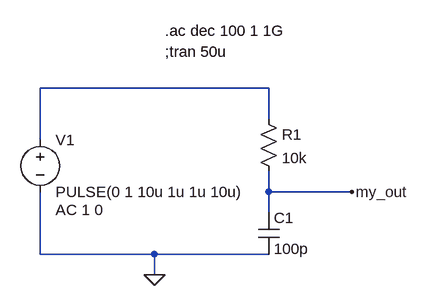
[diagram p0: schematic filtre passe-bas.asc]
filtre passe-bas.asc, the LTspice schematic file:
Version 4
SHEET 1 880 680
WIRE 176 -64 -176 -64
WIRE 176 -16 176 -64
WIRE -176 16 -176 -64
WIRE 176 96 176 64
WIRE 304 96 176 96
WIRE 176 128 176 96
WIRE -176 192 -176 96
WIRE 0 192 -176 192
WIRE 176 192 0 192
WIRE 0 224 0 192
FLAG 304 96 my_out
FLAG 0 224 0
SYMBOL cap 160 128 R0
SYMATTR InstName C1
SYMATTR Value 100p
SYMBOL res 160 -32 R0
SYMATTR InstName R1
SYMATTR Value 10k
SYMBOL voltage -176 0 R0
WINDOW 123 24 124 Left 2
WINDOW 39 0 0 Left 0
SYMATTR InstName V1
SYMATTR Value PULSE(0 1 10u 1u 1u 10u)
SYMATTR Value2 AC 1 0
TEXT 16 -120 Left 2 !;tran 50u
TEXT 16 -152 Left 2 !.ac dec 100 1 1G

The netlist it stands for:
* filtre passe-bas.asc
C1 my_out 0 100p
R1 N001 my_out 10k
V1 N001 0 PULSE(0 1 10u 1u 1u 10u) AC 1 0
;tran 50u
.ac dec 100 1 1G
.backanno
.end

* Results of the author's LTspice run, read from the files saved beside the schematic
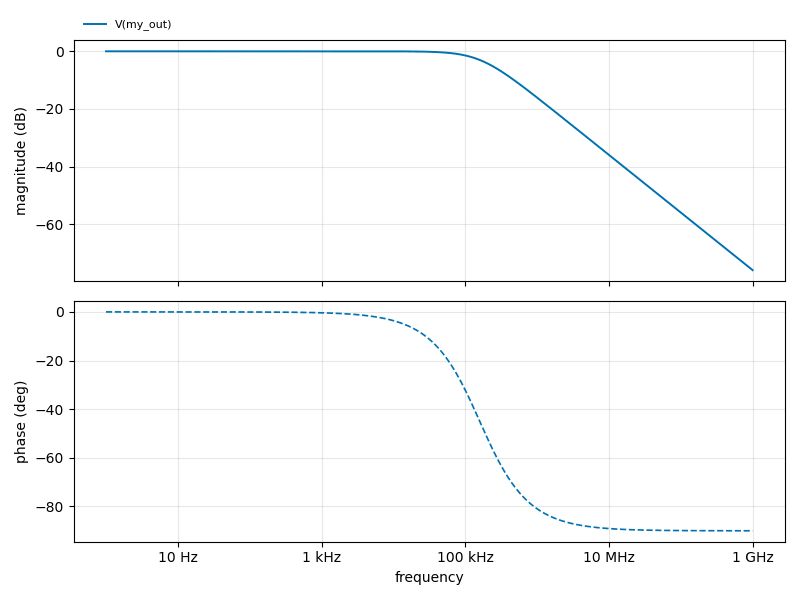
[diagram p1: AC Analysis of filtre passe-bas.asc, plotted from the saved traces]
* AC Analysis, 1 run:
*   V(my_out): -0.00 dB at 1 Hz, -75.96 dB at 1 GHz, peak -0.00 dB at 1 Hz, 3 dB below the peak at 159.1 kHz